# Altium schematic sheet MCU.SchDoc
size A4; SheetNumber: 2; SheetTotal: 2
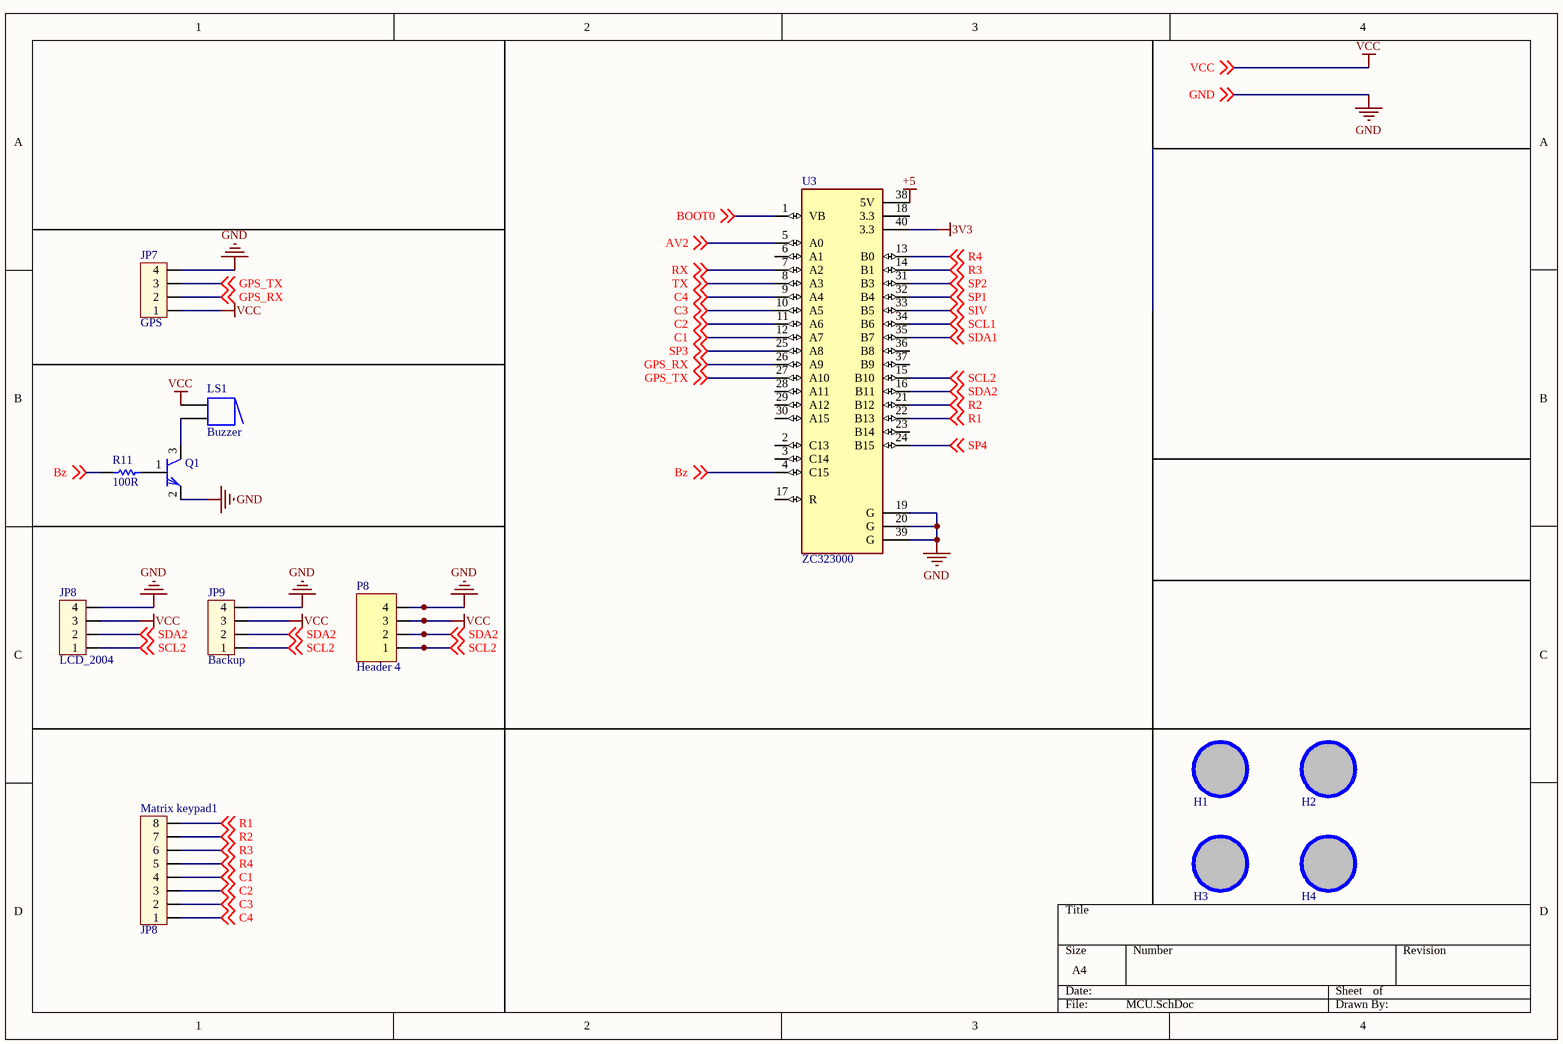
[diagram p0: MCU.SchDoc]

## Parts
H1  Hole  [LO KHOAN 3MM]  (value not drawn)
H2  Hole  [LO KHOAN 3MM]  (value not drawn)
H3  Hole  [LO KHOAN 3MM]  (value not drawn)
H4  Hole  [LO KHOAN 3MM]  (value not drawn)
JP7  GPS  [CON4]
JP8  LCD_2004  [CON4]
JP9  Backup  [CON4]
LS1  Buzzer  [Buzzer]
Matrix_keypad1  JP8  [CON8]
P8  Header 4  [Header 4]
Q1  C1815  [SOT23 [C1815]]  (value not drawn)
R11  value 100R  [R-0805]  (hidden comment: RESISTOR)
U3  ZC323000  [MODULE_ZC323000]

## Nets
3V3: U3.40(3.3)
+5: U3.38(5V)
GND: JP7.4 JP8.4 JP9.4 P8.4 Q1.2(E) U3.19(G) U3.20(G) U3.39(G) ; off-sheet GND
VCC: JP7.1 JP8.3 JP9.3 LS1.1 P8.3 ; off-sheet VCC
AV2: U3.5(A0) ; off-sheet AV2
BOOT0: U3.1(VB) ; off-sheet BOOT0
Bz: R11.1 U3.4(C15) ; off-sheet Bz
C1: Matrix_keypad1.4 U3.12(A7) ; off-sheet C1
C2: Matrix_keypad1.3 U3.11(A6) ; off-sheet C2
C3: Matrix_keypad1.2 U3.10(A5) ; off-sheet C3
C4: Matrix_keypad1.1 U3.9(A4) ; off-sheet C4
GPS_RX: JP7.2 U3.26(A9) ; off-sheet GPS_RX
GPS_TX: JP7.3 U3.27(A10) ; off-sheet GPS_TX
R1: Matrix_keypad1.8 U3.22(B13) ; off-sheet R1
R2: Matrix_keypad1.7 U3.21(B12) ; off-sheet R2
R3: Matrix_keypad1.6 U3.14(B1) ; off-sheet R3
R4: Matrix_keypad1.5 U3.13(B0) ; off-sheet R4
RX: U3.7(A2) ; off-sheet RX
SCL1: U3.34(B6) ; off-sheet SCL1
SCL2: JP8.1 JP9.1 P8.1 U3.15(B10) ; off-sheet SCL2
SDA1: U3.35(B7) ; off-sheet SDA1
SDA2: JP8.2 JP9.2 P8.2 U3.16(B11) ; off-sheet SDA2
SIV: U3.33(B5) ; off-sheet SIV
SP1: U3.32(B4) ; off-sheet SP1
SP2: U3.31(B3) ; off-sheet SP2
SP3: U3.25(A8) ; off-sheet SP3
SP4: U3.24(B15) ; off-sheet SP4
TX: U3.8(A3) ; off-sheet TX
NetLS1_2: LS1.2 Q1.3(C)
NetQ1_1: Q1.1(B) R11.2

Not connected (* = marked no-connect by the designer): H1 1; H2 1; H3 1; H4 1; U3 2(C13) 3(C14) 6(A1) 17(R) 18(3.3) 23(B14) 28(A11) 29(A12) 30(A15) 36(B8) 37(B9)

## Library data of the parts
H1-H4 = Hole: Hole 3mm
JP7-JP9 = Con4: Connector 4; Value: Connector 4
LS1 = Buzzer: Magnetic Transducer Buzzer; Published: 24-Mar-1999; LatestRevisionDate: 17-Dec-2003; LatestRevisionNote: Schematic revised, PCB Footprint replaced.; DatasheetDocument: 17-Dec-2003; PackageReference: ABSM-1574; Publisher: Altium Limited; ComponentLink1Description: Manufacturer Link; ComponentLink1URL: http://www.megastar.com/linecard/buzzmode/index.php
Matrix_keypad1 = Con8: Connector 8; Value: Connector 8
P8 = Header 4: Header, 4-Pin; LatestRevisionDate: 17-Jul-2002; LatestRevisionNote: Re-released for DXP Platform.; Publisher: Altium Limited
Q1 = C1815: Q2SC1815; PSpiceTemplate: Q^@REFDES %c %b %e @MODEL; Vendor: Digikey; COMPONENT: 2SC1815; Published: 13-April-2009; Publisher: Hoang Nguyen; ComponentLink1Description: Digikey Part Link; ComponentLink2Description: Open Datasheet; ComponentLink2URL: H:\LIBRARY\LIBRARY.Datasheet\; Price: 500VND
U3 = ZC323000: STM32F103C8T6 ARM STM32 Minimum System Development Board Module For Arduino; Package: None; MP: ZC323000; Value: *; Availability: Unavailable; Price: None
R11 = RESISTOR: Published: 8-Jun-2000; LatestRevisionDate: 17-Jul-2002; LatestRevisionNote: Re-released for DXP Platform.; PackageReference: AXIAL-0.3; Publisher: Altium Limited